# Altium project AUTO_D_SCHEMATICS.PrjPcb
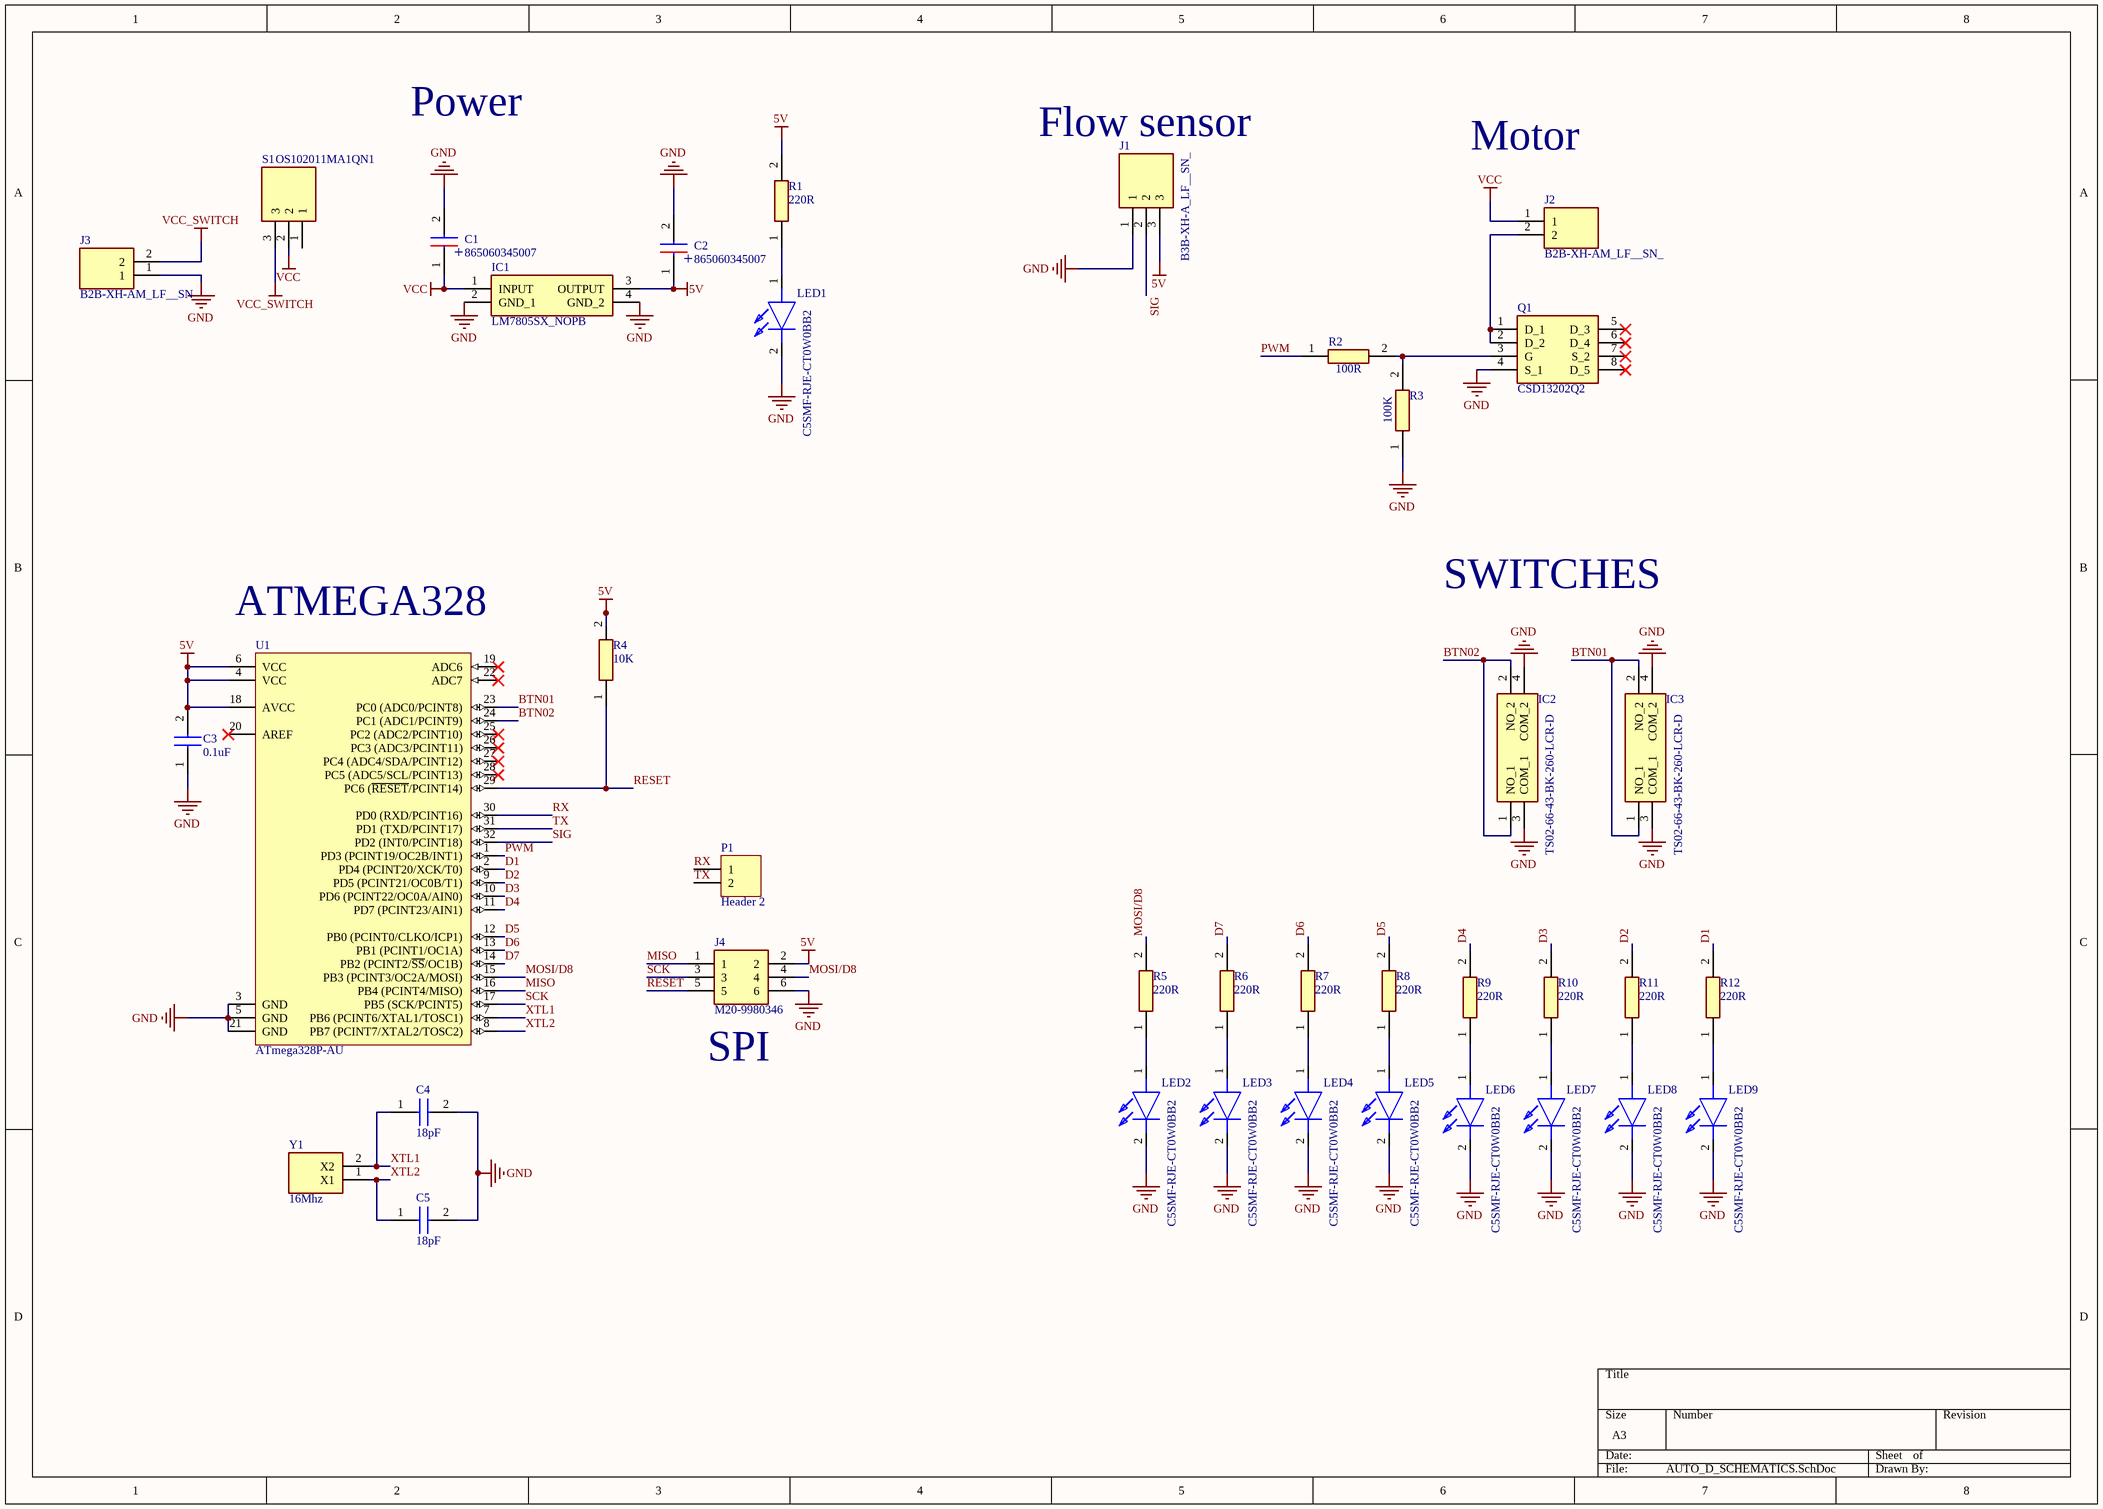
[diagram p0: AUTO_D_SCHEMATICS.SchDoc]
1 sheet, 38 parts. Net scope: global (net labels, ports and power ports of the same name join across sheets).
Board file: AUTO_D_SCHEMATICS.PcbDoc

## Sheet AUTO_D_SCHEMATICS.SchDoc
size A3

### Parts
C1  865060345007  [CAPAE660X770N]
C2  865060345007  [CAPAE660X770N]
C3  0.1uF  [CAPC2012X88N]
C4  18pF  [CAPC2012X135N]
C5  18pF  [CAPC2012X135N]
IC1  LM7805SX_NOPB  [KTT0003B]
IC2  TS02-66-43-BK-260-LCR-D  [TS026643BK260LCRD]
IC3  TS02-66-43-BK-260-LCR-D  [TS026643BK260LCRD]
J1  B3B-XH-A_LF__SN_  [B3BXHALFSN]
J2  B2B-XH-AM_LF__SN_  [B2BXHAMLFSN]
J3  B2B-XH-AM_LF__SN_  [B2BXHAMLFSN]
J4  M20-9980346  [HDRV6W64P254_2X3_762X508X868P]
LED1  C5SMF-RJE-CT0W0BB2  [C5SMFRJECT0W0BB2]
LED2  C5SMF-RJE-CT0W0BB2  [C5SMFRJECT0W0BB2]
LED3  C5SMF-RJE-CT0W0BB2  [C5SMFRJECT0W0BB2]
LED4  C5SMF-RJE-CT0W0BB2  [C5SMFRJECT0W0BB2]
LED5  C5SMF-RJE-CT0W0BB2  [C5SMFRJECT0W0BB2]
LED6  C5SMF-RJE-CT0W0BB2  [C5SMFRJECT0W0BB2]
LED7  C5SMF-RJE-CT0W0BB2  [C5SMFRJECT0W0BB2]
LED8  C5SMF-RJE-CT0W0BB2  [C5SMFRJECT0W0BB2]
LED9  C5SMF-RJE-CT0W0BB2  [C5SMFRJECT0W0BB2]
P1  Header 2  [HDR1X2]
Q1  CSD13202Q2  [CSD16301Q2]
R1  220R  [RESC2012X60N]
R2  100R  [RESC2012X60N]
R3  100K  [RESC2012X60N]
R4  10K  [RESC2012X60N]
R5  220R  [RESC2012X60N]
R6  220R  [RESC2012X60N]
R7  220R  [RESC2012X60N]
R8  220R  [RESC2012X60N]
R9  220R  [RESC2012X60N]
R10  220R  [RESC2012X60N]
R11  220R  [RESC2012X60N]
R12  220R  [RESC2012X60N]
S1  OS102011MA1QN1  [OS102011MA1QN1]
U1  ATmega328P-AU  [32-TQFP (7x7)mm]
Y1  16Mhz  [ABL2-8.000MHZ-D3W-I-T]

### Nets
5V: C2.1(+) C3.2 IC1.3(OUTPUT) J1.3 J4.2 R1.2 R4.2 U1.4(VCC) U1.6(VCC) U1.18(AVCC)
GND: C1.2(-) C2.2(-) C3.1 C4.2 C5.2 IC1.2(GND_1) IC1.4(GND_2) IC2.3(COM_1) IC2.4(COM_2) IC3.3(COM_1) IC3.4(COM_2) J1.1 J3.1 J4.6 LED1.2(K) LED2.2(K) LED3.2(K) LED4.2(K) LED5.2(K) LED6.2(K) LED7.2(K) LED8.2(K) LED9.2(K) Q1.4(S_1) R3.1 U1.3(GND) U1.5(GND) U1.21(GND)
VCC: C1.1(+) IC1.1(INPUT) J2.1 S1.2
VCC_SWITCH: J3.2 S1.3
BTN01: IC3.1(NO_1) IC3.2(NO_2) U1.23(PC0_(ADC0/PCINT8))
BTN02: IC2.1(NO_1) IC2.2(NO_2) U1.24(PC1_(ADC1/PCINT9))
D1: R12.2 U1.2(PD4_(PCINT20/XCK/T0))
D2: R11.2 U1.9(PD5_(PCINT21/OC0B/T1))
D3: R10.2 U1.10(PD6_(PCINT22/OC0A/AIN0))
D4: R9.2 U1.11(PD7_(PCINT23/AIN1))
D5: R8.2 U1.12(PB0_(PCINT0/CLKO/ICP1))
D6: R7.2 U1.13(PB1_(PCINT1/OC1A))
D7: R6.2 U1.14(PB2_(PCINT2/~{SS}/OC1B))
MISO: J4.1 U1.16(PB4_(PCINT4/MISO))
MOSI/D8: J4.4 R5.2 U1.15(PB3_(PCINT3/OC2A/MOSI))
PWM: R2.1 U1.1(PD3_(PCINT19/OC2B/INT1))
RESET: J4.5 R4.1 U1.29(PC6_(~{RESET}/PCINT14))
RX: P1.1 U1.30(PD0_(RXD/PCINT16))
SCK: J4.3 U1.17(PB5_(SCK/PCINT5))
SIG: J1.2 U1.32(PD2_(INT0/PCINT18))
TX: P1.2 U1.31(PD1_(TXD/PCINT17))
XTL1: C4.1 U1.7(PB6_(PCINT6/XTAL1/TOSC1)) Y1.2(X2)
XTL2: C5.1 U1.8(PB7_(PCINT7/XTAL2/TOSC2)) Y1.1(X1)
NetJ2_2: J2.2 Q1.1(D_1) Q1.2(D_2)
NetLED1_1: LED1.1(A) R1.1
NetLED2_1: LED2.1(A) R5.1
NetLED3_1: LED3.1(A) R6.1
NetLED4_1: LED4.1(A) R7.1
NetLED5_1: LED5.1(A) R8.1
NetLED6_1: LED6.1(A) R9.1
NetLED7_1: LED7.1(A) R10.1
NetLED8_1: LED8.1(A) R11.1
NetLED9_1: LED9.1(A) R12.1
NetQ1_3: Q1.3(G) R2.2 R3.2

Not connected (* = marked no-connect by the designer): Q1 5(D_3)* 6(D_4)* 7(S_2)* 8(D_5)*; S1 1; U1 19(ADC6)* 20(AREF)* 22(ADC7)* 25(PC2_(ADC2/PCINT10))* 26(PC3_(ADC3/PCINT11))* 27(PC4_(ADC4/SDA/PCINT12))* 28(PC5_(ADC5/SCL/PCINT13))*

### Notes on the sheet
- Power
- Flow sensor
- Motor
- (near U1) ATMEGA328
- SWITCHES
- (near J4) SPI

### Library data of the parts
C1 C2 = 865060345007: Capacitor; Manufacturer_Name: Wurth Elektronik; Datasheet Link: https://componentsearchengine.com/Datasheets/2/865060345007.pdf; Height: 7.7mm; Manufacturer_Part_Number: 865060345007; Mouser Part Number: 710-865060345007; Mouser Price/Stock: https://www.mouser.co.uk/ProductDetail/Wurth-Elektronik/865060345007?qs=0KOYDY2FL2%2F8lOgt%2FC4iag%3D%3D
C3 = C0805C104K9RACAUTO: Capacitor; Manufacturer_Name: Kemet; Datasheet Link: https://componentsearchengine.com/Datasheets/2/C0805C104K9RACAUTO.pdf; Height: 0.88mm; Manufacturer_Part_Number: C0805C104K9RACAUTO; Mouser Part Number: 80-C0805C104K9RAUTO; Mouser Price/Stock: https://www.mouser.co.uk/ProductDetail/KEMET/C0805C104K9RACAUTO?qs=ds50AKTGxA84SWre%252BvImOA%3D%3D
C4 C5 = C0603C180M5HACTU: Capacitor; Manufacturer_Name: KEMET; Manufacturer_Part_Number: C0603C180M5HACTU
IC1 = LM7805SX_NOPB: Integrated Circuit; Manufacturer_Name: Texas Instruments; Manufacturer_Part_Number: LM7805SX/NOPB; Datasheet Link: http://www.ti.com/lit/gpn/LM7800; Mouser Part Number: 595-LM7805SX/NOPB; Mouser Price/Stock: https://www.mouser.co.uk/ProductDetail/Texas-Instruments/LM7805SX-NOPB?qs=gO6GG99qvRB7s5bGtFssmw%3D%3D; Arrow Part Number: LM7805SX/NOPB; Arrow Price/Stock: https://www.arrow.com/en/products/lm7805sxnopb/texas-instruments?region=nac
IC2 IC3 = TS02-66-43-BK-260-LCR-D: Integrated Circuit; Manufacturer_Name: CUI Inc.; Datasheet Link: https://www.cuidevices.com/product/resource/ts02.pdf; Height: 4.5mm; Manufacturer_Part_Number: TS02-66-43-BK-260-LCR-D; Mouser Part Number: 179-TS026643BK260LCR; Mouser Price/Stock: https://www.mouser.co.uk/ProductDetail/CUI-Devices/TS02-66-43-BK-260-LCR-D?qs=A6eO%252BMLsxmQi%252BNuzcShOvg%3D%3D; Arrow Part Number: TS02-66-43-BK-260-LCR-D; Arrow Price/Stock: https://www.arrow.com/en/products/ts02-66-43-bk-260-lcr-d/cui-devices?region=nac
J1 = B3B-XH-A_LF__SN_: Connector; Manufacturer_Name: JST (JAPAN SOLDERLESS TERMINALS); Manufacturer_Part_Number: B3B-XH-A(LF)(SN); Datasheet Link: https://datasheet.lcsc.com/szlcsc/1812131720_JST-Sales-America-B3B-XH-A-LF-SN_C144394.pdf; Height: 7mm; Arrow Part Number: B3B-XH-A(LF)(SN); Arrow Price/Stock: https://www.arrow.com/en/products/b3b-xh-a-lf-sn/jst-manufacturing
J2 J3 = B2B-XH-AM_LF__SN_: Connector; Manufacturer_Name: JST (JAPAN SOLDERLESS TERMINALS); Manufacturer_Part_Number: B2B-XH-AM(LF)(SN); Datasheet Link: https://www.jst-mfg.com/product/pdf/eng/eXH.pdf; Height: 7mm; Arrow Part Number: B2B-XH-AM(LF)(SN); Arrow Price/Stock: https://www.arrow.com/en/products/b2b-xh-am-lf-sn/jst-manufacturing
J4 = M20-9980346: Connector; Manufacturer_Name: Harwin; Manufacturer_Part_Number: M20-9980346; Mouser Part Number: 855-M20-9980346; Datasheet Link: https://cdn.harwin.com/pdfs/M20-998.pdf?utm_source=3D_PDF&utm_medium=3D_PDF&utm_campaign=3D_PDF; Height: 8.68mm; Mouser Price/Stock: https://www.mouser.co.uk/ProductDetail/Harwin/M20-9980346/?qs=%252Bk6%2F5FB6qrmHk2P20oz3FA%3D%3D
LED1-LED9 = C5SMF-RJE-CT0W0BB2: LED; Manufacturer_Name: Wolfspeed; Datasheet Link: https://www.mouser.com/datasheet/2/723/C5SMF_RJF_RJE_GJF_GJE_BJF_BJE_1240-2256911.pdf; Height: 8.75mm; Manufacturer_Part_Number: C5SMF-RJE-CT0W0BB2; Mouser Part Number: 941-C5SMFRJECT0W0BB2; Mouser Price/Stock: https://www.mouser.co.uk/ProductDetail/Cree-LED/C5SMF-RJE-CT0W0BB2?qs=1sbE9T7hb3bz%2FXMFB8lsHw%3D%3D; Arrow Part Number: C5SMF-RJE-CT0W0BB2; Arrow Price/Stock: https://www.arrow.com/en/products/c5smf-rje-ct0w0bb2/cree?region=nac
P1 = Header 2: Header, 2-Pin; LatestRevisionDate: 17-Jul-2002; LatestRevisionNote: Re-released for DXP Platform.; Publisher: Altium Limited
Q1 = CSD13202Q2: MOSFET (N-Channel); Manufacturer_Name: Texas Instruments; Datasheet Link: http://www.ti.com/lit/gpn/csd13202q2; Manufacturer_Part_Number: CSD13202Q2; Mouser Part Number: 595-CSD13202Q2; Mouser Price/Stock: https://www.mouser.co.uk/ProductDetail/Texas-Instruments/CSD13202Q2?qs=igp4D3uu33Lqy8Xk%2F8NHvg%3D%3D; Arrow Part Number: CSD13202Q2; Arrow Price/Stock: https://www.arrow.com/en/products/csd13202q2/texas-instruments
R1 R5-R12 = RC0805FR-07220RL: Resistor; Manufacturer_Name: YAGEO (PHYCOMP); Manufacturer_Part_Number: RC0805FR-07220RL
R2 = RC0805FR-07100RL: Resistor; Manufacturer_Name: YAGEO (PHYCOMP); Manufacturer_Part_Number: RC0805FR-07100RL
R3 = RC0805FR-07100KL: Resistor; Manufacturer_Name: YAGEO (PHYCOMP); Manufacturer_Part_Number: RC0805FR-07100KL
R4 = CRCW080510K0FKEAC: Resistor; Manufacturer_Name: Vishay; Manufacturer_Part_Number: CRCW080510K0FKEAC; Mouser Part Number: 71-CRCW080510K0FKEAC; Datasheet Link: https://mouser.componentsearchengine.com/Datasheets/1/CRCW080510K0FKEAC.pdf; Height: 0.6mm; Mouser Price/Stock: https://www.mouser.co.uk/ProductDetail/Vishay-Dale/CRCW080510K0FKEAC?qs=E3Y5ESvWgWORadmUijPtxQ%3D%3D; Arrow Part Number: CRCW080510K0FKEAC; Arrow Price/Stock: https://www.arrow.com/en/products/crcw080510k0fkeac/vishay?region=nac
S1 = OS102011MA1QN1: Switch; Manufacturer_Name: C & K COMPONENTS; Datasheet Link: http://www.ckswitches.com/media/1428/os.pdf; Manufacturer_Part_Number: OS102011MA1QN1; Mouser Part Number: 611-OS102011MA1QN1; Mouser Price/Stock: https://www.mouser.co.uk/ProductDetail/CK/OS102011MA1QN1?qs=WtljUlYws5R6MUgHcLkz4w%3D%3D; Arrow Part Number: OS102011MA1QN1; Arrow Price/Stock: https://www.arrow.com/en/products/os102011ma1qn1/ck?region=europe
U1 = ATmega328P-AU: 8-bit Microcontrollers - MCU 32KB In-system Flash 20MHz 1.8V-5.5V; Manufacturer_Name: Microchip Technology / Atmel; Manufacturer_Part_Number: ATMEGA328P-AU
Y1 = ABL-16.000MHZ-B2: Crystal or Oscillator; Manufacturer_Name: ABRACON; Manufacturer_Part_Number: ABL-16.000MHZ-B2